# Altium schematic sheet External_Debug_Interface.SchDoc: Schematic sheet title to update
size A4; Date: Not used; ApprovedBy: Not used; CheckedBy: Not used; Author: Not used; CompanyName: STMicroelectronics; DrawnBy: Not used; Engineer: Not used; Organization: Not used; Address1: Not used; Address2: Not used; Address3: Not used; Address4: Not used; DocumentNumber: Not used; Revision: Not used; SheetNumber: 7; SheetTotal: 7; CurrentTime: Not used; CurrentDate: Not used; Time: Not used; DocumentFullPathAndName: Not used; DocumentName: Not used; ModifiedDate: Not used; ImagePath: Not used; ProjectName: Not used; Application_BuildNumber: Not used
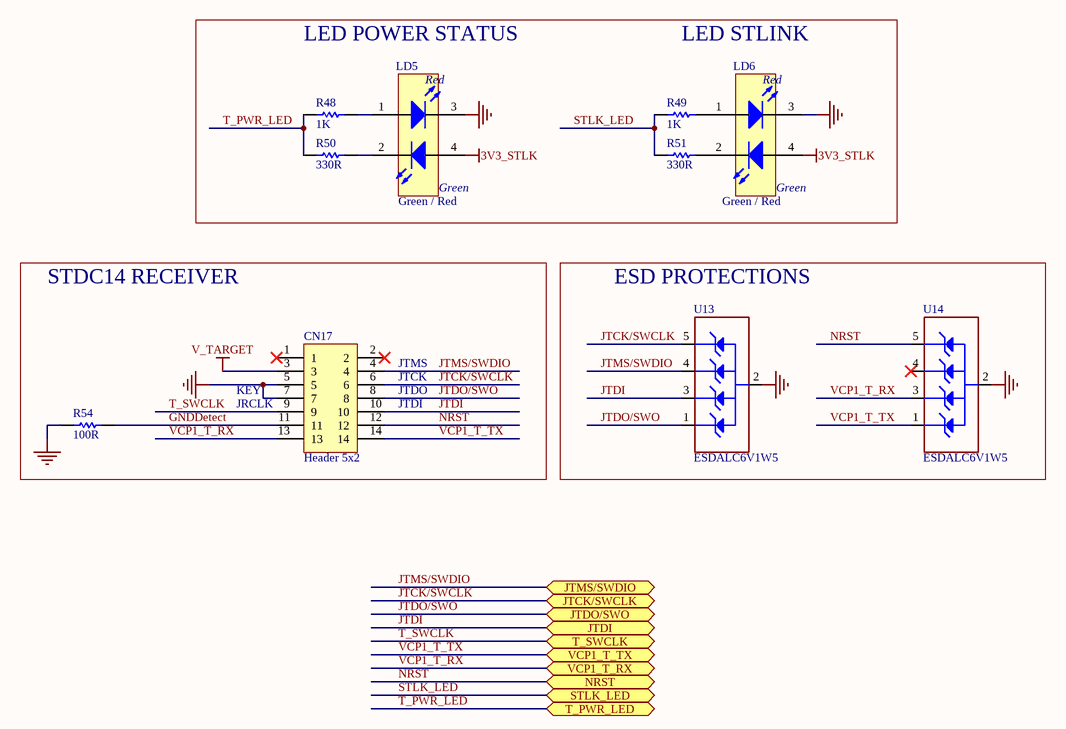
[diagram p0: External_Debug_Interface.SchDoc]

## Parts
CN17  value Header 5x2  [CON_STDC14_Receiver_MEDIUM_WITH_MIPI10_3D]  (hidden comment: Header 7x2)
LD5  value Green / Red  [LED_BI-GR_WE-150141SV73110]  (hidden comment: LED_BICOLOR)
LD6  value Green / Red  [LED_BI-GR_WE-150141SV73110]  (hidden comment: LED_BICOLOR)
R48  value 1K  [R0402]  (hidden comment: Resistor)
R49  value 1K  [R0402]  (hidden comment: Resistor)
R50  value 330R  [R0402]  (hidden comment: Resistor)
R51  value 330R  [R0402]  (hidden comment: Resistor)
R54  value 100R  [R0402]  (hidden comment: Resistor)
U13  ESDALC6V1W5  [ESD_SOT323-5L]
U14  ESDALC6V1W5  [ESD_SOT323-5L]

## Blocks framed on the sheet
STDC14 RECEIVER: CN17 R54
ESD PROTECTIONS: U13 U14

## Ports
JTCK/SWCLK (bidir), JTDI (bidir), JTDO/SWO (bidir), JTMS/SWDIO (bidir), NRST (bidir), STLK_LED (bidir), T_PWR_LED (bidir), T_SWCLK (bidir), VCP1_T_RX (bidir), VCP1_T_TX (bidir)

## Nets
3V3_STLK: LD5.4(Green_anode) LD6.4(Green_anode)
GND: CN17.5 CN17.7 LD5.3(RED_cathode) LD6.3(RED_cathode) R54.1 U13.2(GND) U14.2(GND)
V_TARGET: CN17.3
GNDDetect: CN17.11 R54.2
JTCK/SWCLK: CN17.6 U13.5(IO4) ; port JTCK/SWCLK
JTDI: CN17.10 U13.3(IO2) ; port JTDI
JTDO/SWO: CN17.8 U13.1(IO1) ; port JTDO/SWO
JTMS/SWDIO: CN17.4 U13.4(IO3) ; port JTMS/SWDIO
NRST: CN17.12 U14.5(IO4) ; port NRST
STLK_LED: R49.2 R51.1 ; port STLK_LED
T_PWR_LED: R48.2 R50.2 ; port T_PWR_LED
T_SWCLK: CN17.9 ; port T_SWCLK
VCP1_T_RX: CN17.13 U14.3(IO2) ; port VCP1_T_RX
VCP1_T_TX: CN17.14 U14.1(IO1) ; port VCP1_T_TX
NetLD5_1: LD5.1(Red_anode) R48.1
NetLD5_2: LD5.2(Green_cathode) R50.1
NetLD6_1: LD6.1(Red_anode) R49.1
NetLD6_2: LD6.2(Green_cathode) R51.2

Not connected (* = marked no-connect by the designer): CN17 1* 2*; U14 4(IO3)*

## Notes on the sheet
- LED POWER STATUS
- LED STLINK
- (near CN17) JRCLK
- (near CN17) KEY
- (near CN17) JTMS
- (near CN17) JTCK
- (near CN17) JTDO
- (near CN17) JTDI
- Title:
- Project:
- Size:
- Revision:
- Variant:
- A4
- -
- Date:
- Reference:
- Sheet:
- of
- (in symbol MCD-02631) Red; Green

## Library data of the parts
CN17 = MCD-01226: Header, 5x2, 1.27mm, VR, SMD, T=5.97mm/3.05mm; Part_Type: Connector; Part_Preference: Recommended; Manufacturer: SAMTEC; Manufacturer_Part_Number: FTSH-105-01-L-DV-K; Order_Code_RS: 159-2332; Component_Country_Of_Origin: China, Costa Rica, Malaysia, United States, Vietnam; Internal_Part_Number: MCD-01226; Status: Released; ComponentLink1URL: http://tunmcdsvn.tun.st.com/Component_Documentation_Library/Trunk/Connector/SAMTEC_FTSH_Series/; Order_Code_Digikey: SAM8799-ND; Order_Code_Farnell: 2856879
LD5 LD6 = MCD-02631: LED Bicolor, Green/Red, 2V, 20mA,  4-PLCC; Part_Type: Display; Part_Preference: Recommended; Manufacturer: WURTH ELEKTRONIK; Manufacturer_Part_Number: 150141SV73110; Order_Code_RS: 184-6963; Internal_Part_Number: MCD-02631; Status: Checked; Package: 4-PLCC; ComponentLink1URL: http://tunmcdsvn.tun.st.com/Component_Documentation_Library/Trunk/Display/WURTH_ELEKTRONIK_150141SV73110; Order_Code_Digikey: 732-13404-2-ND; Order_Code_Farnell: 2990869
R48 = MCD-02665: Resistor, 1K, 0402, +/-0.1%, 1/16W, +/-25ppm/°C; Part_Preference: Recommended; Manufacturer: YAGEO; Manufacturer_Part_Number: RT0402BRD071KL; Order_Code_RS: 199-1298; Component_Country_Of_Origin: Taiwan; ShowFields: YES; ID: 4771; Internal_Part_Number: MCD-02665; Status: Checked; Part_Type: Resistor; Package: 0402; ComponentLink1URL: http://tunmcdsvn.tun.st.com/Component_Documentation_Library/Trunk/Resistor/YAGEO_RT_Series; Order_Code_Digikey: YAG1386TR-ND; Order_Code_Farnell: 3496475
R49 = MCD-02665: Resistor, 1K, 0402, +/-0.1%, 1/16W, +/-25ppm/°C; Part_Preference: Recommended; Manufacturer: YAGEO; Manufacturer_Part_Number: RT0402BRD071KL; Order_Code_RS: 199-1298; Internal_Part_Number: MCD-02665; Status: Checked; Part_Type: Resistor; Package: 0402; ComponentLink1URL: http://tunmcdsvn.tun.st.com/Component_Documentation_Library/Trunk/Resistor/YAGEO_RT_Series; Order_Code_Digikey: YAG1386TR-ND; Order_Code_Farnell: 3496475
R50 R51 = MCD-00062: Resistor, 330R, 0402, +/-1%, 1/16W; Part_Preference: Recommended; Manufacturer: YAGEO; Manufacturer_Part_Number: RC0402FR-07330RL; Component_Country_Of_Origin: China; Internal_Part_Number: MCD-00062; Status: Released; Part_Type: Resistor; Package: 0402; ComponentLink1URL: http://tunmcdsvn.tun.st.com/Component_Documentation_Library/Trunk/Resistor/YAGEO_RC_L_Series; Order_Code_Digikey: 311-330LRCT-ND; Order_Code_Farnell: 9239170; Order_Code_RS: N/A
R54 = MCD-00067: Resistor, 100R, 0402, +/- 1%, 1/16W; Part_Preference: Recommended; Manufacturer: YAGEO; Manufacturer_Part_Number: RC0402FR-07100RL; Order_Code_RS: 9239111; Component_Country_Of_Origin: China; ShowFields: YES; ID: 2527; Internal_Part_Number: MCD-00067; Status: Released; Part_Type: Resistor; Package: 0402; ComponentLink1URL: http://tunmcdsvn.tun.st.com/Component_Documentation_Library/Trunk/Resistor/YAGEO_RC_L_Series; Order_Code_Digikey: 311-100LRCT-ND; Order_Code_Farnell: 9239111
U13 U14 = MCD-00136: Dual Transil array for ESD protection; BMS_Part_Number: 9151112; Part_Type: Diode; Part_Preference: Recommended; Manufacturer: STMICROELECTRONICS; Manufacturer_HQ_COO: EU; Component_Country_Of_Origin: China; Internal_Part_Number: MCD-00136; Value: ESDALC6V1W5; Status: Released; Manufacturer_Part_Number: ESDALC6V1W5; ComponentLink1URL: http://tunmcdsvn.tun.st.com/Component_Datasheet_Library/Trunk/Diodes/STM_ESD_ESDALC6V1W5